# Altium schematic sheet 1lab_vodoreziv_rs485.SchDoc: =title_line_1 + title_line_2
size 594 x 420 mm; SheetNumber: n
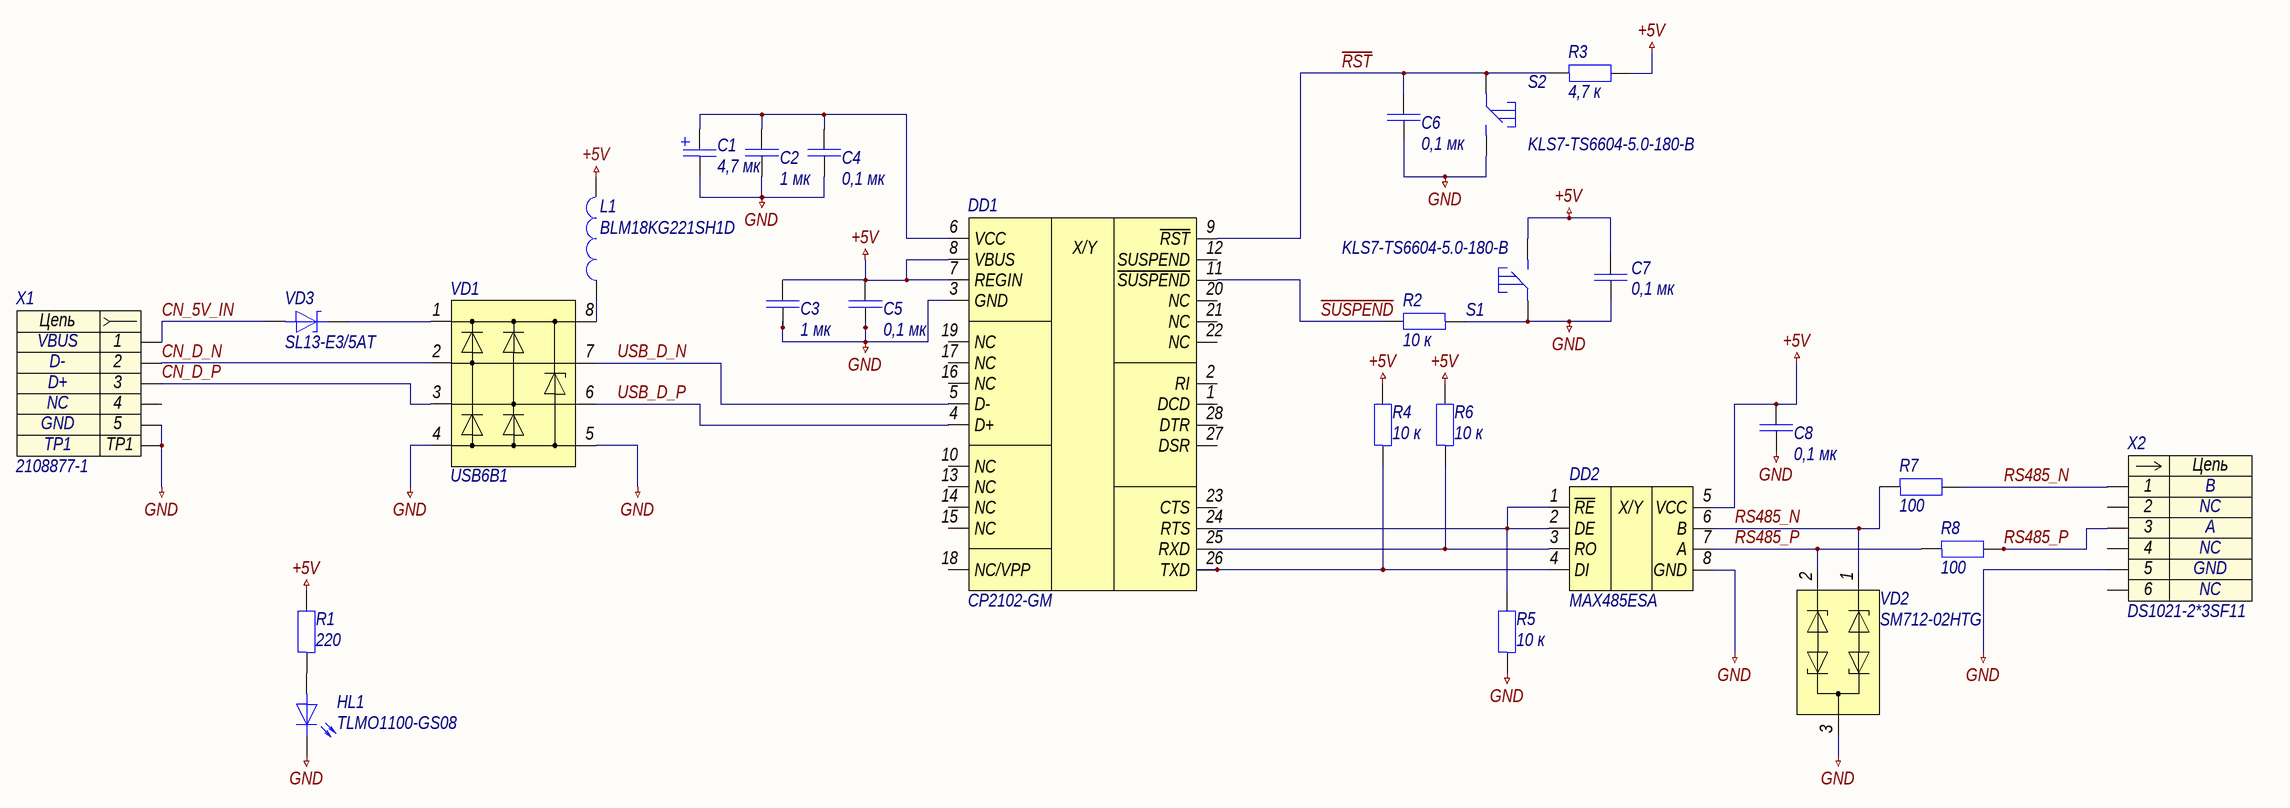
[diagram p0: 1lab_vodoreziv_rs485.SchDoc]

## Parts
C1  4,7 мк  [C1206POLAR]
C2  1 мк  [C0603]
C3  1 мк  [C0603]
C4  0,1 мк  [C0603]
C5  0,1 мк  [C0603]
C6  0,1 мк  [C0603]
C7  0,1 мк  [C0603]
C8  0,1 мк  [C0603]
DD1  CP2102-GM  [QFN-24]
DD2  MAX485ESA  [SOIC-8]
HL1  TLMO1100-GS08  [HL0603]
L1  BLM18KG221SH1D  [BLM-2-0603]
R1  220  [R0603]
R2  10 к  [R0603]
R3  4,7 к  [R0603]
R4  10 к  [R0603]
R5  10 к  [R0603]
R6  10 к  [R0603]
R7  100  [R0603]
R8  100  [R0603]
S1  KLS7-TS6604-5.0-180-B  [KLS7-TS6604_500]
S2  KLS7-TS6604-5.0-180-B  [KLS7-TS6604_500]
VD1  USB6B1  [SO-8]
VD2  SM712-02HTG  [SOT23-3]
VD3  SL13-E3/5AT  [DO-214AC]
X1  2108877-1  [2108877-1]
X2  DS1021-2*3SF11  [DS1021-2X3SF11]

## Nets
+5V: C3.2 C5.2 C7.2 C8.1 DD1.7(REGIN) DD1.8(VBUS) DD2.5(VCC) L1.2 R1.2 R3.2 R4.2 R6.2 S1.2
GND: C1.2 C2.2 C3.1 C4.2 C5.1 C6.2 C7.1 C8.2 DD1.3(GND) DD2.8(GND) HL1.1 R2.1 R5.1 S1.1 S2.2 VD1.4 VD1.5 VD2.3 X1.5 X1.TP1 X2.5
~{RST}: C6.1 DD1.9(~{RST}) R3.1 S2.1
~{SUSPEND}: DD1.11(~{SUSPEND}) R2.2
CN_5V_IN: VD3.2 X1.1
CN_D_N: VD1.2 X1.2
CN_D_P: VD1.3 X1.3
RS485_N: DD2.6(B) R7.1 R7.2 VD2.1 X2.1
RS485_P: DD2.7(A) R8.1 R8.2 VD2.2 X2.3
USB_D_N: DD1.5(D-) VD1.7
USB_D_P: DD1.4(D+) VD1.6
NetC1_1: C1.1 C2.1 C4.1 DD1.6(VCC)
NetDD1_24: DD1.24(RTS) DD2.1(~{RE}) DD2.2(DE) R5.2
NetDD1_25: DD1.25(RXD) DD2.3(RO) R6.1
NetDD1_26: DD1.26(TXD) DD2.4(DI) R4.1
NetHL1_2: HL1.2 R1.1
NetL1_1: L1.1 VD1.8
NetVD1_1: VD1.1 VD3.1

Not connected (* = marked no-connect by the designer): DD1 1(DCD) 2(RI) 10(NC) 12(SUSPEND) 13(NC) 14(NC) 15(NC) 16(NC) 17(NC) 18(NC/VPP) 19(NC) 20(NC) 21(NC) 22(NC) 23(CTS) 27(DSR) 28(DTR); X1 4; X2 2 4 6

## Notes on the sheet
- Перв. примен.
- Справ. №
- Подп. и дата
- Инв. № дубл.
- Нормоконтроль:
- Взам. инв. №
- Изм.
- Лист
- № докум.
- Подп.
- Дата
- Лит.
- Масса
- Масштаб
- Т.контр.
- Пров.
- Разраб.
- Листов
- Разработал:
- Инв. № подл.
- Н.контр.
- Утв.
- Копировал
- Формат
- А2
- (in symbol dd0008) X/Y
- (in symbol dd0009) X/Y
- (in symbol HEADER-5-TP1-SCT) Цепь
- (in symbol x0003) Цепь

## Library data of the parts
C1 = c0009: =Описание; ID: c0009; Фамилия: Водорезов; Описание: Конденсатор чип 1206 4,7 мкФ 25 В ±10 % полярный; Наименование: 293D105X9025A2TE3; Производитель: Vishay Intertechnology, Inc.; Отклонение: ±10 %; Номинальное напряжение: 25 В; Рабочие температуры: от -55 °С до +125 °С; Корпус: 1206; Номинал: 4,7 мк; HelpURL: https://www.vishay.com/capacitors/list/product-40002/
C2 = c0004: =Описание; ID: c0004; Фамилия: Ларионов; Описание: Конденсатор чип 0603 1 мкФ 25 В ±10 %; Наименование: CC0603KRX7R8BB105; Производитель: Yageo; Отклонение: ±10 %; Номинальное напряжение: 25 В; Рабочие температуры: от -55 °С до +125 °С; Корпус: 0603; Номинал: 1 мк; HelpURL: https://www.yageo.com/upload/media/product/products/datasheet/mlcc/UPY-GPHC_X7R_6.3V-to-50V_20.pdf
C3 = C-NONPOLAR: =Описание; ID: c0004; Фамилия: Ларионов; Описание: Конденсатор чип 0603 1 мкФ 25 В ±10 %; Наименование: CC0603KRX7R8BB105; Производитель: Yageo; Отклонение: ±10 %; Номинальное напряжение: 25 В; Рабочие температуры: от -55 °С до +125 °С; Корпус: 0603; Номинал: 1 мк; HelpURL: https://www.yageo.com/upload/media/product/products/datasheet/mlcc/UPY-GPHC_X7R_6.3V-to-50V_20.pdf
C4 C5 = C-NONPOLAR: =Описание; ID: c0002; Фамилия: Ларионов; Описание: Конденсатор чип 0603 0,1 мкФ 50 В ±5 %; Наименование: CC0603JRX7R9BB104; Производитель: Yageo; Отклонение: ±5 %; Номинальное напряжение: 50 В; Рабочие температуры: от -55 °С до +125 °С; Корпус: 0603; Номинал: 0,1 мк; HelpURL: https://www.yageo.com/upload/media/product/products/datasheet/mlcc/UPY-GPHC_X7R_6.3V-to-50V_20.pdf
C6-C8 = c0002: =Описание; ID: c0002; Фамилия: Ларионов; Описание: Конденсатор чип 0603 0,1 мкФ 50 В ±5 %; Наименование: CC0603JRX7R9BB104; Производитель: Yageo; Отклонение: ±5 %; Номинальное напряжение: 50 В; Рабочие температуры: от -55 °С до +125 °С; Корпус: 0603; Номинал: 0,1 мк; HelpURL: https://www.yageo.com/upload/media/product/products/datasheet/mlcc/UPY-GPHC_X7R_6.3V-to-50V_20.pdf
DD1 = dd0008: =Описание; ID: dd0008; Фамилия: Водорезов; Описание: Преобразователь USB-UART; Производитель: Silicon Laboratories Inc.; Наименование: CP2102-GM; Корпус: QFN-24; HelpURL: https://www.silabs.com/interface/usb-bridges/classic/device.cp2102
DD2 = dd0009: =Описание; ID: dd0009; Фамилия: Водорезов; Описание: Передатчик RS-485/RS-422; Производитель: Maxim Integrated Products; Наименование: MAX485ESA; Корпус: SOIC-8; HelpURL: https://www.maximintegrated.com/en/products/interface/transceivers/MAX485.html
HL1 = HL-COMMON: =Описание; ID: hl0004; Фамилия: Ларионов; Описание: Светодиод чип 0603 оранжевый; Производитель: Vishay Intertechnology, Inc.; Цвет: Orange; Номинальная сила света: 80 мкд; Номинальная длина волны: 606 нм; Номинальный прямой ток: 30 мА; Номинальное падение напряжения: 2,1 В; Рассеиваемая мощность: 90 мВт; Рабочие температуры: от -40 °С до +100 °С; Корпус: 0603; Наименование: TLMO1100-GS08; HelpURL: https://www.vishay.com/leds/list/product-83173/
L1 = FERRITE-BEAD: =Описание; ID: l0001; Фамилия: Ларионов; Описание: Ферритовая бусина 220 Ом ±25 %; Производитель: Murata Manufacturing Co., Ltd.; Сопротивление, 100 МГц: 220 Ом; Отклонение, 100 Мгц: ±25 %; Сопротивление при постоянном токе: 0,05 Ом; Рабочие температуры: от -55 °С до +125 °С; Корпус: 0603; Наименование: BLM18KG221SH1D; HelpURL: https://www.murata.com/en-global/products/productdetail.aspx?partno=BLM18KG221SH1%23
R1 = R-COMMON: =Описание; ID: r0005; Фамилия: Ларионов; Описание: Резистор чип 0603 220 Ом ±1 % 0,1 Вт; Наименование: RC0603FR-07220RL; Производитель: Yageo; Отклонение: ±1 %; Номинальное напряжение: 75 В; Рабочие температуры: от -55 °С до +155 °С; Номинальный ток: 1 А; Корпус: 0603; Номинал: 220; HelpURL: https://www.yageo.com/upload/media/product/productsearch/datasheet/rchip/PYu-RC_Group_51_RoHS_L_11.pdf
R2 = R-COMMON: =Описание; ID: r0008; Фамилия: Самарин; Описание: Резистор чип 0603 10 кОм ±1 % 0,1 Вт; Наименование: RC0603FR-0710KL; Производитель: Yageo; Отклонение: ±1 %; Номинальное напряжение: 75 В; Рабочие температуры: от -55 °С до +155 °С; Номинальный ток: 1 А; Корпус: 0603; Номинал: 10 к; HelpURL: https://www.yageo.com/upload/media/product/productsearch/datasheet/rchip/PYu-RC_Group_51_RoHS_L_11.pdf
R3 = R-COMMON: =Описание; ID: r0007; Фамилия: Ларионов; Описание: Резистор чип 0603 4,7 кОм ±1 % 0,1 Вт; Наименование: RC0603FR-074K7L; Производитель: Yageo; Отклонение: ±1 %; Номинальное напряжение: 75 В; Рабочие температуры: от -55 °С до +155 °С; Номинальный ток: 1 А; Корпус: 0603; Номинал: 4,7 к; HelpURL: https://www.yageo.com/upload/media/product/productsearch/datasheet/rchip/PYu-RC_Group_51_RoHS_L_11.pdf
R4-R6 = r0008: =Описание; ID: r0008; Фамилия: Самарин; Описание: Резистор чип 0603 10 кОм ±1 % 0,1 Вт; Наименование: RC0603FR-0710KL; Производитель: Yageo; Отклонение: ±1 %; Номинальное напряжение: 75 В; Рабочие температуры: от -55 °С до +155 °С; Номинальный ток: 1 А; Корпус: 0603; Номинал: 10 к; HelpURL: https://www.yageo.com/upload/media/product/productsearch/datasheet/rchip/PYu-RC_Group_51_RoHS_L_11.pdf
R7 R8 = r0004: =Описание; ID: r0004; Фамилия: Самарин; Описание: Резистор чип 0603 100 Ом ±1 % 0,1 Вт; Наименование: RC0603FR‍‐07100RL; Производитель: Yageo; Отклонение: ±1 %; Номинальное напряжение: 75 В; Рабочие температуры: от -55 °С до +155 °С; Номинальный ток: 1 А; Корпус: 0603; Номинал: 100; HelpURL: https://www.yageo.com/upload/media/product/productsearch/datasheet/rchip/PYu-RC_Group_51_RoHS_L_11.pdf
S1 S2 = KLS7-TS6604-5.0-180-B: id: sw0003; Капустин: Черемный; Описание: Тактовая кнопка поверхностного монтажа; Производитель: KLS; Количество контактов: 4; Ток нагрузки: 50 мА @ 12 В; Сопротивление контакта: 50 мОм; Промывка: Не указано (запрещена); Температура окружающей среды (корпуса), мин#: -20 °C; Температура окружающей среды (корпуса), макс#: +70 °C; Корпус: 6х6х3,5; Наименование: KLS7-TS6604-5.0-180-B; HelpURL: http://www.klsele.com/admin/product_upload/20120515130956KLS7-TS6604.pdf
VD1 = USB6B1: =Описание; ID: vd0005; Фамилия: Ларионов; Описание: Диодная сборка для подавления помех, от 6 В; Производитель: STMicroelectronics; Наименование: USB6B1; Корпус: SO-8; HelpURL: https://www.st.com/content/st_com/en/products/protection-devices/esd-protection/usb-port-protection/usb6b1.html
VD2 = vd0003: =Описание; ID: vd0003; Фамилия: Самарин; Описание: Диодная сборка для подавления помех, -7/12 В; Производитель: Littelfuse, Inc.; Наименование: SM712-02HTG; Корпус: SOT23-3; HelpURL: https://www.littelfuse.com/products/tvs-diode-arrays/general-purpose-esd-protection/sm712.aspx
VD3 = vd0001: =Описание; ID: vd0001; Фамилия: Ларионов; Описание: Диод Шоттки 30 В 1,5 А; Производитель: Vishay Intertechnology, Inc.; Пиковое прямое напряжение: 0,445 В; Импульсное обратное напряжение: 30 В; Макс# допустимый средний прямой ток: 1,5 А; Рабочие температуры: от -55 °С до +125 °С; Наименование: SL13-E3/5AT; Корпус: DO-214AC; HelpURL: https://www.vishay.com/product?docid=88740
X1 = HEADER-5-TP1-SCT: Contact_1: VBUS; Contact_2: D-; Contact_3: D+; Contact_4: NC; Contact_5: GND; ID: x0001; Фамилия: Ларионов; Описание: USB 2.0 Micro USB Type B IP68 гнездо прямой угол; Производитель: TE Connectivity; Наименование: 2108877-1; HelpURL: https://www.te.com/global-en/product-2108877-1.html
X2 = x0003: Contact_1: B; Contact_2: NC; Contact_3: A; Contact_5: GND; ID: x0003; Фамилия: Самарин; Описание: PLS 3x2 pin 2,54 мм прямой; Производитель: Connfly Electronic Co. LTD; Contact_4: NC; Contact_6: NC; Наименование: DS1021-2*3SF11; HelpURL: http://www.connfly.com/productshow.aspx?id=118